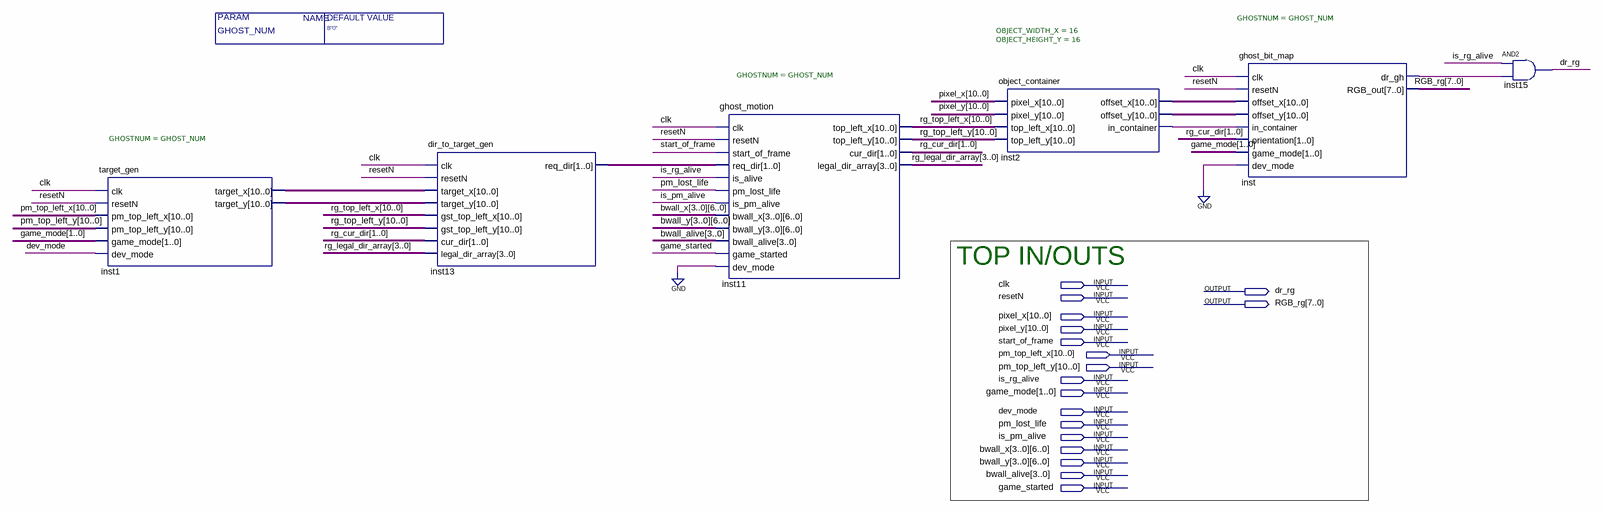
[diagram p0: schematic sheet]
// Quartus schematic TOP_RED_GHOST.bdf as structural Verilog: 6 symbols, 18 pins
module TOP_RED_GHOST #(parameter GHOST_NUM = 'b0) (
  input  clk,
  input  resetN,
  input  [10:0] pixel_x,
  input  [10:0] pixel_y,
  input  start_of_frame,
  input  [10:0] pm_top_left_x,
  input  [10:0] pm_top_left_y,
  input  is_rg_alive,
  input  [1:0] game_mode,
  input  dev_mode,
  input  pm_lost_life,
  input  is_pm_alive,
  input  [6:0] bwall_x_3,
  input  [6:0] bwall_x_2,
  input  [6:0] bwall_x_1,
  input  [6:0] bwall_x_0,
  input  [6:0] bwall_y_3,
  input  [6:0] bwall_y_2,
  input  [6:0] bwall_y_1,
  input  [6:0] bwall_y_0,
  input  [3:0] bwall_alive,
  input  game_started,
  output dr_rg,
  output [7:0] RGB_rg
);

  wire inst2_in_container, inst_dr_gh;
  wire [1:0] inst13_req_dir, rg_cur_dir;
  wire [3:0] rg_legal_dir_array;
  wire [10:0] inst1_target_x, inst1_target_y, inst2_offset_x, inst2_offset_y, rg_top_left_x, rg_top_left_y;

  target_gen #(.GHOSTNUM(GHOST_NUM)) inst1 (
    .clk(clk), .resetN(resetN), .pm_top_left_x(pm_top_left_x), .pm_top_left_y(pm_top_left_y),
    .game_mode(game_mode), .dev_mode(dev_mode), .target_x(inst1_target_x), .target_y(inst1_target_y));
  dir_to_target_gen inst13 (
    .clk(clk), .resetN(resetN), .target_x(inst1_target_x), .target_y(inst1_target_y),
    .gst_top_left_x(rg_top_left_x), .gst_top_left_y(rg_top_left_y), .cur_dir(rg_cur_dir),
    .legal_dir_array(rg_legal_dir_array), .req_dir(inst13_req_dir));
  ghost_motion #(.GHOSTNUM(GHOST_NUM)) inst11 (
    .clk(clk), .resetN(resetN), .start_of_frame(start_of_frame), .req_dir(inst13_req_dir),
    .is_alive(is_rg_alive), .pm_lost_life(pm_lost_life), .is_pm_alive(is_pm_alive),
    .bwall_x({bwall_x_3, bwall_x_2, bwall_x_1, bwall_x_0}),
    .bwall_y({bwall_y_3, bwall_y_2, bwall_y_1, bwall_y_0}), .bwall_alive(bwall_alive),
    .game_started(game_started), .dev_mode(1'b0), .top_left_x(rg_top_left_x), .top_left_y(rg_top_left_y),
    .cur_dir(rg_cur_dir), .legal_dir_array(rg_legal_dir_array));
  object_container #(.OBJECT_WIDTH_X(16), .OBJECT_HEIGHT_Y(16)) inst2 (
    .pixel_x(pixel_x), .pixel_y(pixel_y), .top_left_x(rg_top_left_x), .top_left_y(rg_top_left_y),
    .offset_x(inst2_offset_x), .offset_y(inst2_offset_y), .in_container(inst2_in_container));
  ghost_bit_map #(.GHOSTNUM(GHOST_NUM)) inst (
    .clk(clk), .resetN(resetN), .offset_x(inst2_offset_x), .offset_y(inst2_offset_y),
    .in_container(inst2_in_container), .orientation(rg_cur_dir), .game_mode(game_mode), .dev_mode(1'b0),
    .dr_gh(inst_dr_gh), .RGB_out(RGB_rg));
  and inst15 (dr_rg, is_rg_alive, inst_dr_gh);

  // Notes on the sheet:
  //   TOP IN/OUTS
endmodule
